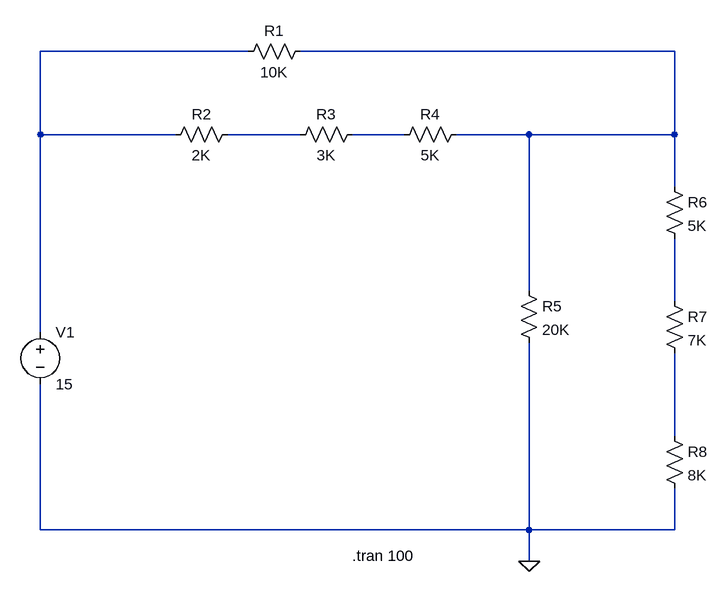
[diagram p0: schematic LTSPİCE.asc]
LTSPİCE.asc, the LTspice schematic file:
Version 4
SHEET 1 880 836
WIRE 64 32 -256 32
WIRE 720 32 144 32
WIRE -256 160 -256 32
WIRE -48 160 -256 160
WIRE 144 160 32 160
WIRE 304 160 224 160
WIRE 496 160 384 160
WIRE 720 160 720 32
WIRE 720 160 496 160
WIRE 720 240 720 160
WIRE 496 400 496 160
WIRE 720 416 720 320
WIRE -256 464 -256 160
WIRE 720 624 720 496
WIRE -256 768 -256 544
WIRE 496 768 496 480
WIRE 496 768 -256 768
WIRE 720 768 720 704
WIRE 720 768 496 768
WIRE 496 816 496 768
FLAG 496 816 0
SYMBOL res 160 16 R90
WINDOW 0 0 56 VBottom 2
WINDOW 3 32 56 VTop 2
SYMATTR InstName R1
SYMATTR Value 10K
SYMBOL res 48 144 R90
WINDOW 3 32 56 VTop 2
WINDOW 0 0 56 VBottom 2
SYMATTR Value 2K
SYMATTR InstName R2
SYMATTR SpiceLine tol=1 pwr=0.1
SYMBOL res 240 144 R90
WINDOW 0 0 56 VBottom 2
WINDOW 3 32 56 VTop 2
SYMATTR InstName R3
SYMATTR Value 3K
SYMBOL res 400 144 R90
WINDOW 0 0 56 VBottom 2
WINDOW 3 32 56 VTop 2
SYMATTR InstName R4
SYMATTR Value 5K
SYMBOL res 480 384 R0
SYMATTR InstName R5
SYMATTR Value 20K
SYMBOL res 704 224 R0
SYMATTR InstName R6
SYMATTR Value 5K
SYMBOL res 704 400 R0
SYMATTR InstName R7
SYMATTR Value 7K
SYMBOL res 704 608 R0
SYMATTR InstName R8
SYMATTR Value 8K
SYMBOL voltage -256 448 R0
WINDOW 123 0 0 Left 0
WINDOW 39 0 0 Left 0
SYMATTR InstName V1
SYMATTR Value 15
TEXT 224 808 Left 2 !.tran 100

The netlist it stands for:
* LTSPİCE.asc
R1 N002 N001 10K
R2 N003 N001 2K tol=1 pwr=0.1
R3 N004 N003 3K
R4 N002 N004 5K
R5 N002 0 20K
R6 N002 N005 5K
R7 N005 N006 7K
R8 N006 0 8K
V1 N001 0 15
.tran 100
.backanno
.end